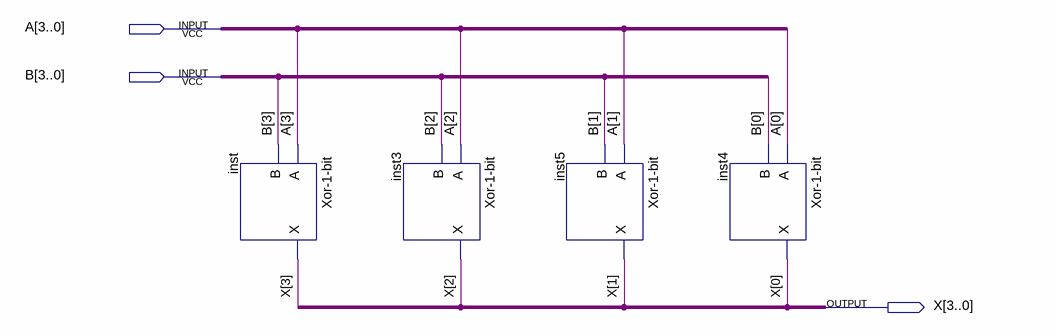
[diagram p0: schematic sheet]
// Quartus schematic Xor-4-bits.bdf as structural Verilog: 4 symbols, 3 pins
module \Xor-4-bits  (
  input  [3:0] A,
  input  [3:0] B,
  output [3:0] X
);

  \Xor-1-bit  inst (.A(A[3]), .B(B[3]), .X(X[3]));
  \Xor-1-bit  inst3 (.A(A[2]), .B(B[2]), .X(X[2]));
  \Xor-1-bit  inst5 (.A(A[1]), .B(B[1]), .X(X[1]));
  \Xor-1-bit  inst4 (.A(A[0]), .B(B[0]), .X(X[0]));
endmodule
